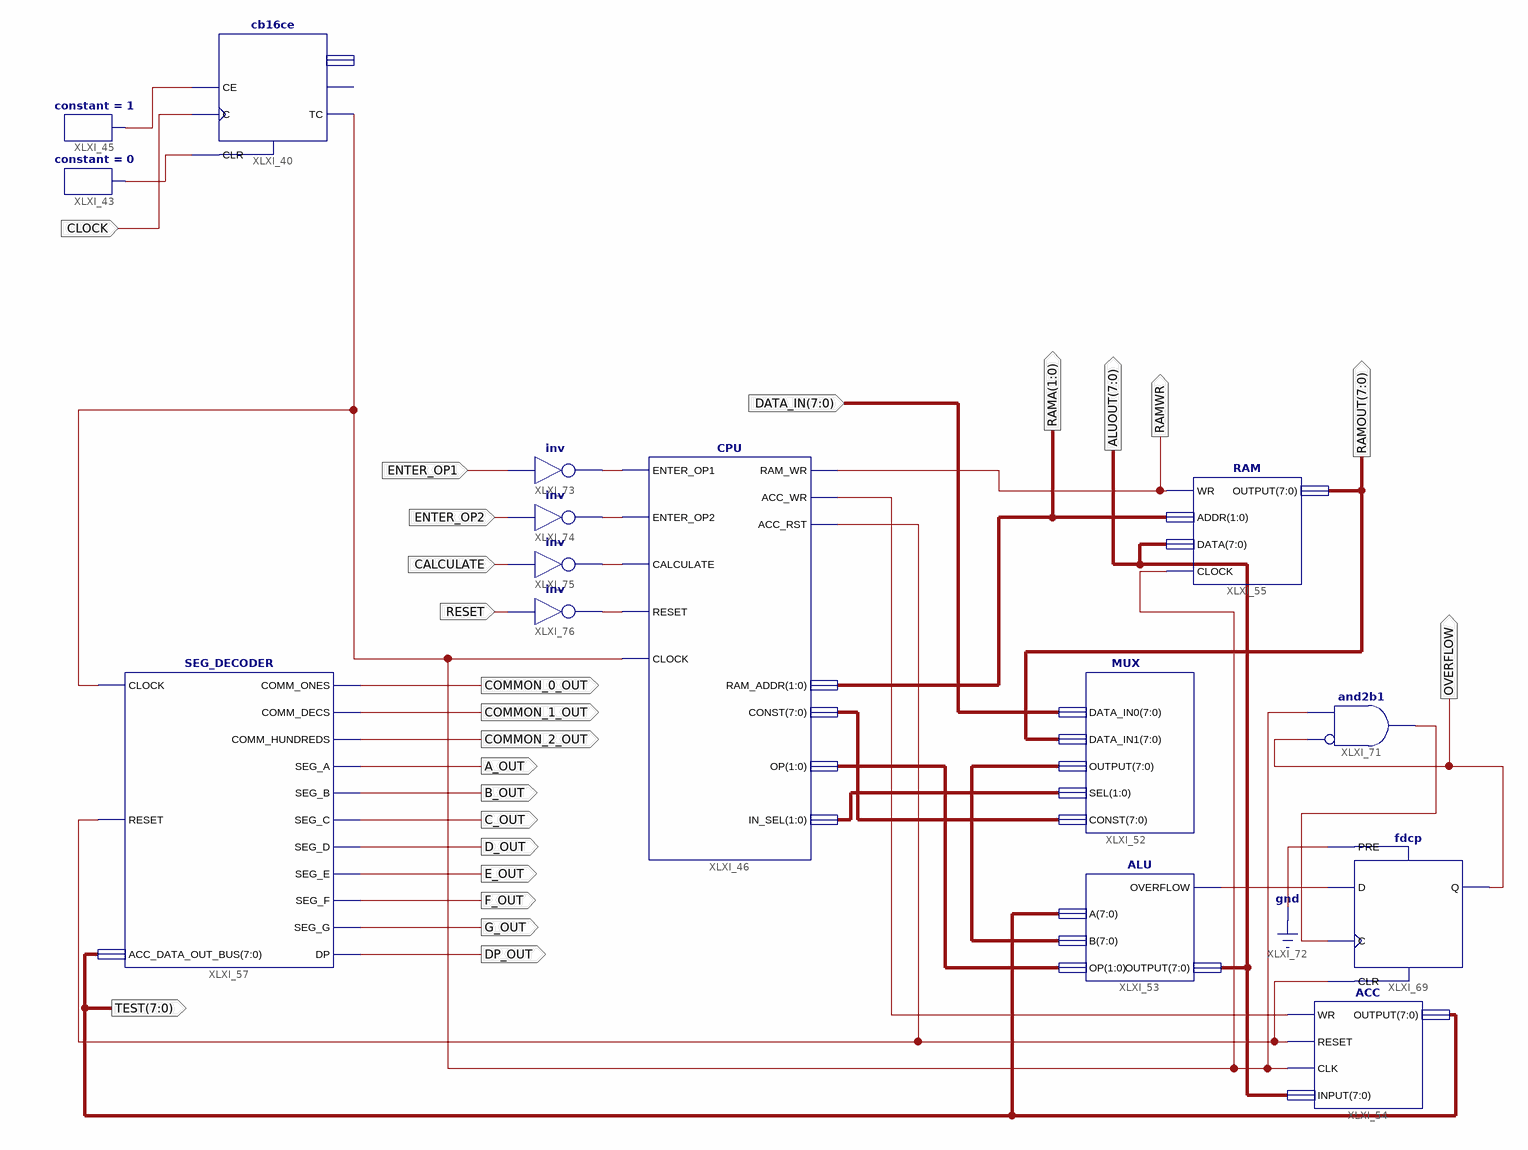
[diagram p0: schematic sheet 1]
// Xilinx ISE schematic TopLevel.sch (spartan3a) as structural Verilog: 15 symbols, 23 ports
module TopLevel (
  input  CLOCK,
  input  [7:0] DATA_IN,
  input  ENTER_OP1,
  input  ENTER_OP2,
  input  CALCULATE,
  input  RESET,
  output [7:0] TEST,
  output [7:0] ALUOUT,
  output [7:0] RAMOUT,
  output RAMWR,
  output [1:0] RAMA,
  output COMMON_0_OUT,
  output COMMON_1_OUT,
  output COMMON_2_OUT,
  output A_OUT,
  output B_OUT,
  output C_OUT,
  output D_OUT,
  output E_OUT,
  output F_OUT,
  output G_OUT,
  output DP_OUT,
  output OVERFLOW
);

  wire CCLK, CLK, EOP2, XLXN_92, XLXN_99, XLXN_120, XLXN_160, XLXN_165, XLXN_172, XLXN_173, XLXN_177;
  wire [1:0] OP, XLXN_168;
  wire [7:0] B, XLXN_113;

  cb16ce XLXI_40 (.C(CLOCK), .CE(XLXN_99), .CLR(XLXN_92), .TC(CLK));  // open: CEO, Q
  constant #(.CValue("0")) XLXI_43 (.O(XLXN_92));
  constant #(.CValue("1")) XLXI_45 (.O(XLXN_99));
  CPU XLXI_46 (
    .ENTER_OP1(EOP2), .ENTER_OP2(XLXN_177), .CALCULATE(XLXN_172), .RESET(XLXN_173), .CLOCK(CLK),
    .RAM_WR(RAMWR), .ACC_WR(XLXN_120), .ACC_RST(CCLK), .RAM_ADDR(RAMA), .CONST(XLXN_113), .IN_SEL(XLXN_168),
    .OP(OP));
  MUX XLXI_52 (.SEL(XLXN_168), .CONST(XLXN_113), .DATA_IN0(DATA_IN), .DATA_IN1(RAMOUT), .OUTPUT(B));
  ALU XLXI_53 (.A(TEST), .B(B), .OP(OP), .OVERFLOW(XLXN_160), .OUTPUT(ALUOUT));
  ACC XLXI_54 (.WR(XLXN_120), .RESET(CCLK), .CLK(CLK), .INPUT(ALUOUT), .OUTPUT(TEST));
  RAM XLXI_55 (.WR(RAMWR), .ADDR(RAMA), .DATA(ALUOUT), .OUTPUT(RAMOUT), .CLOCK(CLK));
  SEG_DECODER XLXI_57 (
    .CLOCK(CLK), .RESET(CCLK), .ACC_DATA_OUT_BUS(TEST), .COMM_ONES(COMMON_0_OUT), .COMM_DECS(COMMON_1_OUT),
    .COMM_HUNDREDS(COMMON_2_OUT), .SEG_A(A_OUT), .SEG_B(B_OUT), .SEG_C(C_OUT), .SEG_D(D_OUT), .SEG_E(E_OUT),
    .SEG_F(F_OUT), .SEG_G(G_OUT), .DP(DP_OUT));
  fdcp XLXI_69 (.C(XLXN_165), .CLR(CCLK), .D(XLXN_160), .PRE(1'b0), .Q(OVERFLOW));
  and XLXI_71 (XLXN_165, ~OVERFLOW, CLK);  // and2b1
  not XLXI_73 (EOP2, ENTER_OP1);
  not XLXI_74 (XLXN_177, ENTER_OP2);
  not XLXI_75 (XLXN_172, CALCULATE);
  not XLXI_76 (XLXN_173, RESET);
endmodule
